# Altium project MasterRelayModule.PrjPcb
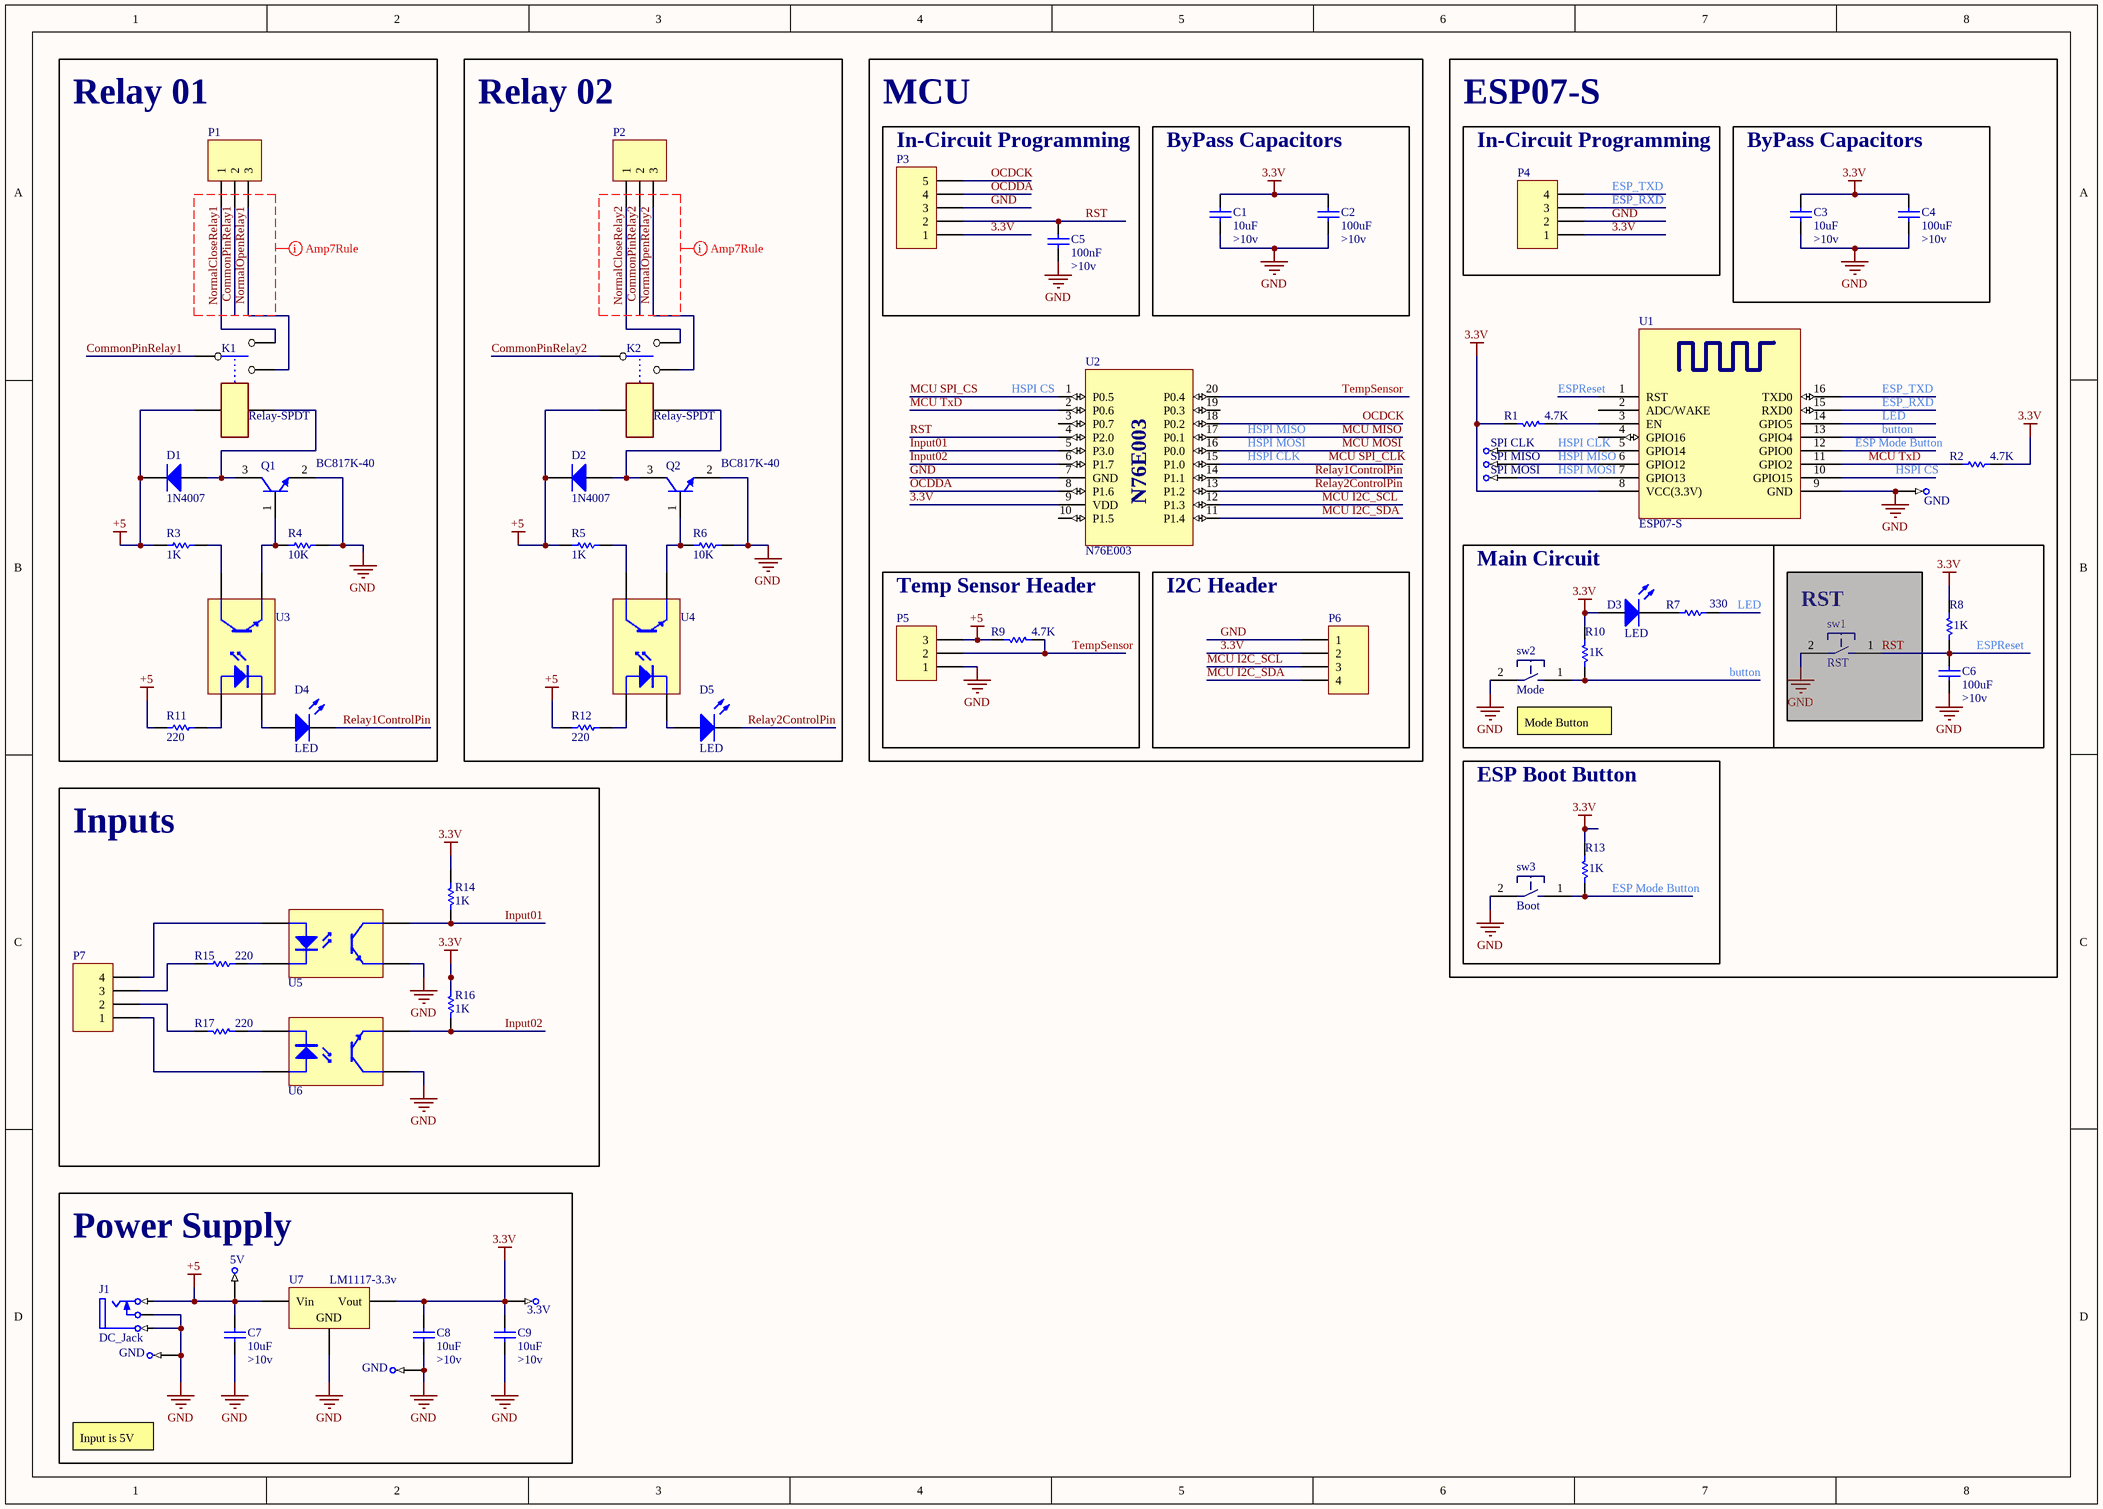
[diagram p0: MasterRelayModule.SchDoc]
1 sheet, 61 parts. Net scope: global (net labels, ports and power ports of the same name join across sheets).
Board file: MasterRelayModule.PcbDoc

## Sheet MasterRelayModule.SchDoc
size A3; SheetNumber: 1; SheetTotal: 1

### Parts
C1  Volte: >10v  [MY_1210]  (hidden comment: 10uF)
C2  Volte: >10v  [MY_1210]  (hidden comment: 100uF)
C3  Volte: >10v  [MY_1210]  (hidden comment: 10uF)
C4  Volte: >10v  [MY_1210]  (hidden comment: 100uF)
C5  Volte: >10v  [MY_1210]  (hidden comment: 100nF)
C6  Volte: >10v  [MY_1210]  (hidden comment: 100uF)
C7  Volte: >10v  [MY_1210]  (hidden comment: 10uF)
C8  Volte: >10v  [MY_1210]  (hidden comment: 10uF)
C9  Volte: >10v  [MY_1210]  (hidden comment: 10uF)
D1  1N4007  [MY_SMA]
D2  1N4007  [MY_SMA]
D3  LED  [MY_LED_0805]
D4  LED  [MY_LED_0805]
D5  LED  [MY_LED_0805]
J1  DC_Jack  [My_DC_Jack]
K1  Relay-SPDT  [My_rel]
K2  Relay-SPDT  [My_rel]
P1  Header 3  [MY_MSTBA3]  (value not drawn)
P2  Header 3  [MY_MSTBA3]  (value not drawn)
P3  Header 5  [My_1X05]  (value not drawn)
P4  Header 4  [My_1X04]  (value not drawn)
P5  Header 3  [My_1X03]  (value not drawn)
P6  Header 4  [MY_FE04W]  (value not drawn)
P7  Header 4  [MY_MSTBA4]  (value not drawn)
Q1  BC817K-40  [INF-SOT23_N]
Q2  BC817K-40  [INF-SOT23_N]
R1  4.7K  [MY_0805]
R2  4.7K  [MY_0805]
R3  1K  [MY_0805]
R4  10K  [MY_0805]
R5  1K  [MY_0805]
R6  10K  [MY_0805]
R7  330  [MY_0805]
R8  1K  [MY_0805]
R9  4.7K  [MY_0805]
R10  1K  [MY_0805]
R11  220  [MY_0805]
R12  220  [MY_0805]
R13  1K  [MY_0805]
R14  1K  [MY_0805]
R15  220  [MY_0805]
R16  1K  [MY_0805]
R17  220  [MY_0805]
sw1  RST  [MY_TACTILE-SMD]
sw2  Mode  [MY_TACTILE-SMD]
sw3  Boot  [MY_TACTILE-SMD]
TP1  SPI CLK  [MY_Testpad1]  (no BOM)
TP2  SPI MISO  [MY_Testpad1]  (no BOM)
TP3  SPI MOSI  [MY_Testpad1]  (no BOM)
TP4  5V  [MY_Testpad1]  (no BOM)
TP5  3.3V  [MY_Testpad1]  (no BOM)
TP6  GND  [MY_Testpad1]  (no BOM)
TP7  GND  [MY_Testpad1]  (no BOM)
TP8  GND  [MY_Testpad1]  (no BOM)
U1  ESP07-S  [ESP07-S]
U2  N76E003  [SOP_20]
U3  Optoisolator  [MY_OPTO_SMD4-7]  (value not drawn)
U4  Optoisolator  [MY_OPTO_SMD4-7]  (value not drawn)
U5  Optoisolator  [MY_OPTO_SMD4-7]  (value not drawn)
U6  Optoisolator  [MY_OPTO_SMD4-7]  (value not drawn)
U7  LM1117-3.3v  [MY_SOT223]

### Blocks framed on the sheet
Relay 01: D1 D4 K1 P1 Q1 R3 R4 R11 U3
Relay 02: D2 D5 K2 P2 Q2 R5 R6 R12 U4
In-Circuit Programming: U2
In-Circuit Programming: R1 R2 TP1-TP3 TP8 U1
MCU: C5 P3
ByPass Capacitors: C1 C2
ESP07-S: P4
ByPass Capacitors: C3 C4
Main Circuit: C6 D3 R7 R8 R10 sw2
Temp Sensor Header: P5 R9
I2C Header: P6
RST: sw1
ESP Boot Button: R13 sw3
Inputs: P7 R14-R17 U5 U6
Power Supply: C7-C9 J1 TP4-TP7 U7

### Nets
3.3V: C1.2 C2.2 C3.2 C4.2 C8.2 C9.2 D3.A P3.1 P4.1 P6.2 R1.1 R2.1 R8.1 R10.1 R13.1 R14.1 R16.1 TP5.1 U1.8(VCC(3.3V)) U2.9(VDD) U7.2(Vout)
+5: C7.2 D1.K D2.K J1.1(T) K1.4 K2.4 P5.3 R3.2 R5.2 R9.1 R11.2 R12.2 TP4.1 U7.3(Vin)
GND: C1.1 C2.1 C3.1 C4.1 C5.1 C6.1 C7.1 C8.1 C9.1 J1.2(TN) J1.3(S) P3.3 P4.2 P5.1 P6.1 Q1.2(E) Q2.2(E) R4.1 R6.1 sw1.2 sw2.2 sw3.2 TP6.1 TP7.1 TP8.1 U1.9(GND) U2.7(GND) U5.3(E) U6.4(C) U7.1(GND)
button: R10.2 sw2.1 U1.13(GPIO4)
CommonPinRelay1: K1.1 P1.2
CommonPinRelay2: K2.1 P2.2
ESP Mode Button: R13.2 sw3.1 U1.12(GPIO0)
ESP_RXD: P4.3 U1.15(RXD0)
ESP_TXD: P4.4 U1.16(TXD0)
ESPReset: C5.2 C6.2 P3.2 R8.2 sw1.1 U1.1(RST) U2.4(P2.0)  [also labelled RST]
HSPI CLK: TP1.1 U1.5(GPIO14) U2.15(P1.0)  [also labelled MCU SPI_CLK]
HSPI CS: U1.10(GPIO15) U2.1(P0.5)  [also labelled MCU SPI_CS]
HSPI MISO: TP2.1 U1.6(GPIO12) U2.17(P0.1)  [also labelled MCU MISO]
HSPI MOSI: TP3.1 U1.7(GPIO13) U2.16(P0.0)  [also labelled MCU MOSI]
Input01: R14.2 U2.5(P3.0) U5.4(C)
Input02: R16.2 U2.6(P1.7) U6.3(E)
LED: R7.2 U1.14(GPIO5)
MCU I2C_SCL: P6.3 U2.12(P1.3)
MCU I2C_SDA: P6.4 U2.11(P1.4)
MCU TxD: R2.2 U1.11(GPIO2) U2.2(P0.6)
NormalCloseRelay1: K1.2 P1.1
NormalCloseRelay2: K2.2 P2.1
NormalOpenRelay1: K1.3 P1.3
NormalOpenRelay2: K2.3 P2.3
OCDCK: P3.5 U2.18(P0.2)
OCDDA: P3.4 U2.8(P1.6)
Relay1ControlPin: D4.K U2.14(P1.1)
Relay2ControlPin: D5.K U2.13(P1.2)
TempSensor: P5.2 R9.2 U2.20(P0.4)
NetD1_A: D1.A K1.5 Q1.3(C)
NetD2_A: D2.A K2.5 Q2.3(C)
NetD3_K: D3.K R7.1
NetD4_A: D4.A U3.2(K)
NetD5_A: D5.A U4.2(K)
NetP7_1: P7.1 U6.1(A)
NetP7_2: P7.2 R17.2
NetP7_3: P7.3 R15.2
NetP7_4: P7.4 U5.1(A)
NetQ1_1: Q1.1(B) R4.2 U3.3(E)
NetQ2_1: Q2.1(B) R6.2 U4.3(E)
NetR1_2: R1.2 U1.3(EN)
NetR3_1: R3.1 U3.4(C)
NetR5_1: R5.1 U4.4(C)
NetR11_1: R11.1 U3.1(A)
NetR12_1: R12.1 U4.1(A)
NetR15_1: R15.1 U5.2(K)
NetR17_1: R17.1 U6.2(K)

Not connected (* = marked no-connect by the designer): U1 2(ADC/WAKE) 4(GPIO16); U2 3(P0.7) 10(P1.5) 19(P0.3)

### Layout directives
rule Width Constraint [Pref Width = 80mil    Min Width = 80mil    Max Width = 100mil]; rule Clearance Constraint [Clearance = 30mil]: CommonPinRelay1, CommonPinRelay2, NormalCloseRelay1, NormalCloseRelay2, NormalOpenRelay1, NormalOpenRelay2

### Notes on the sheet
- Mode Button
- Input is 5V

### Library data of the parts
C1-C9 = Cap ceramic: None polar capacitor; ASiD Part Number: C-AS
  C1 C3 C7-C9: Value: 10uF
  C2 C4 C6: Value: 100uF
  C5: Value: 100nF
D1 D2 = 1N4007: 1 Amp Diode; ASiD Part Number: 1n4007-AS
D3-D5 = LED: Typical INFRARED GaAs LED; ASiD Part Number: LED-AS
J1 = DC_Jack: ASiD Part Number: DC_Jack-AS
K1 K2 = Relay-SPDT: Standard single contact relay; ASiD Part Number: Relay-SPDT-AS
P1 P2 P5 = Header 3: Header, 3-Pin; ASiD Part Number: Header 3-AS
P3 = Header 5: Header, 5-Pin; ASiD Part Number: Header 5-AS
P4 P6 P7 = Header 4: Header, 4-Pin; ASiD Part Number: Header 4-AS
Q1 Q2 = BC817K-40: NPN Silicon AF Transistor, 45 V VCEO, 500 mA IC, SOT23, Reel, Green; Manufacturer: Infineon; fT (typ): 170 MHz; Green: TRUE; IBM (max): 200 mA; IC: 100 mA; IC (max): 500 mA; ICBO (max): 100 nA; ICM (max): 1,000 mA; Ptot (max): 500 mW; VCBO (max): 50 V; VCE: 1 V; VCEO (max): 45 V; VEBO (max): 5 V; PackageVersion: Apr-08; PackageReference: SOT23; PackageDescription: 3-Pin Small Outline Transistor Package, 1.3 x 2.9 mm Body, 0.95 mm Pitch; Packing: Reel; Polarity: NPN; Mounting Technology: Surface Mount; PartNumber: BC817K-40; ComponentLink1Description: Manufacturer URL; ComponentLink1URL: http://www.infineon.com/; ComponentLink2Description: Datasheet; ComponentLink2URL: http://www.infineon.com/dgdl/bc817Kseries_bc818Kseries.pdf?folderId=db3a304314dca389011545f4eb561884&fileId=db3a304314dca38901154636aab91919; ComponentLink3Description: Package Specification; ComponentLink3URL: http://www.infineon.com/dgdl/SOT23-Package_Overview.pdf?folderId=db3a30431936bc4b0119532290053c66&fileId=db3a30431936bc4b0119533468123c85
R1-R17 = Res: Standard resistor; ASiD Part Number: Res-AS
  R1 R2 R9: Value: 4.7K
  R3 R5 R8 R10 R13 R14 R16: Value: 1K
  R4 R6: Value: 10K
  R7: Value: 330
  R11 R12 R15 R17: Value: 220
sw1-sw3 = Tac switch: small tac switch; ASiD Part Number: Tac switch-AS
TP1-TP8 = Test Point: ASiD Part Number: Test Point-AS
U3-U6 = Optoisolator: ASiD Part Number: Optoisolator-AS
U7 = LM1117: Low Drop Voltage Reg; ASiD Part Number: LM1117-AS